# Altium schematic sheet Processor.SchDoc
size A2; Organization: Altium Limited; Address1: L3, 12a Rodborough Rd; Address2: Frenchs Forest; Address3: NSW; Address4: Australia 2086
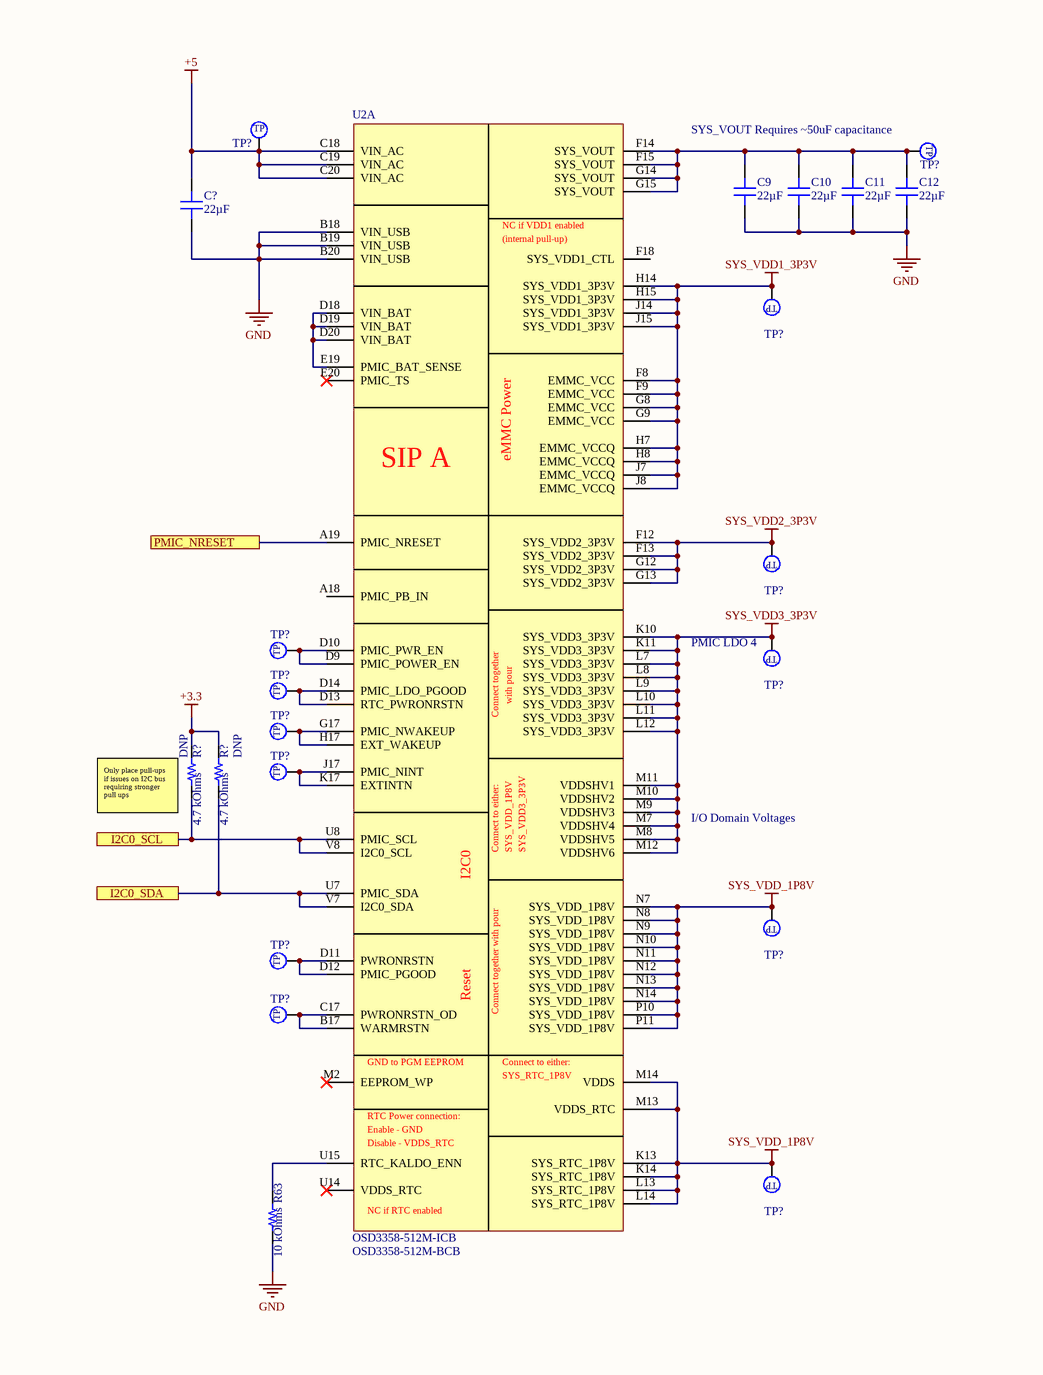
[diagram p0: Processor.SchDoc, left]
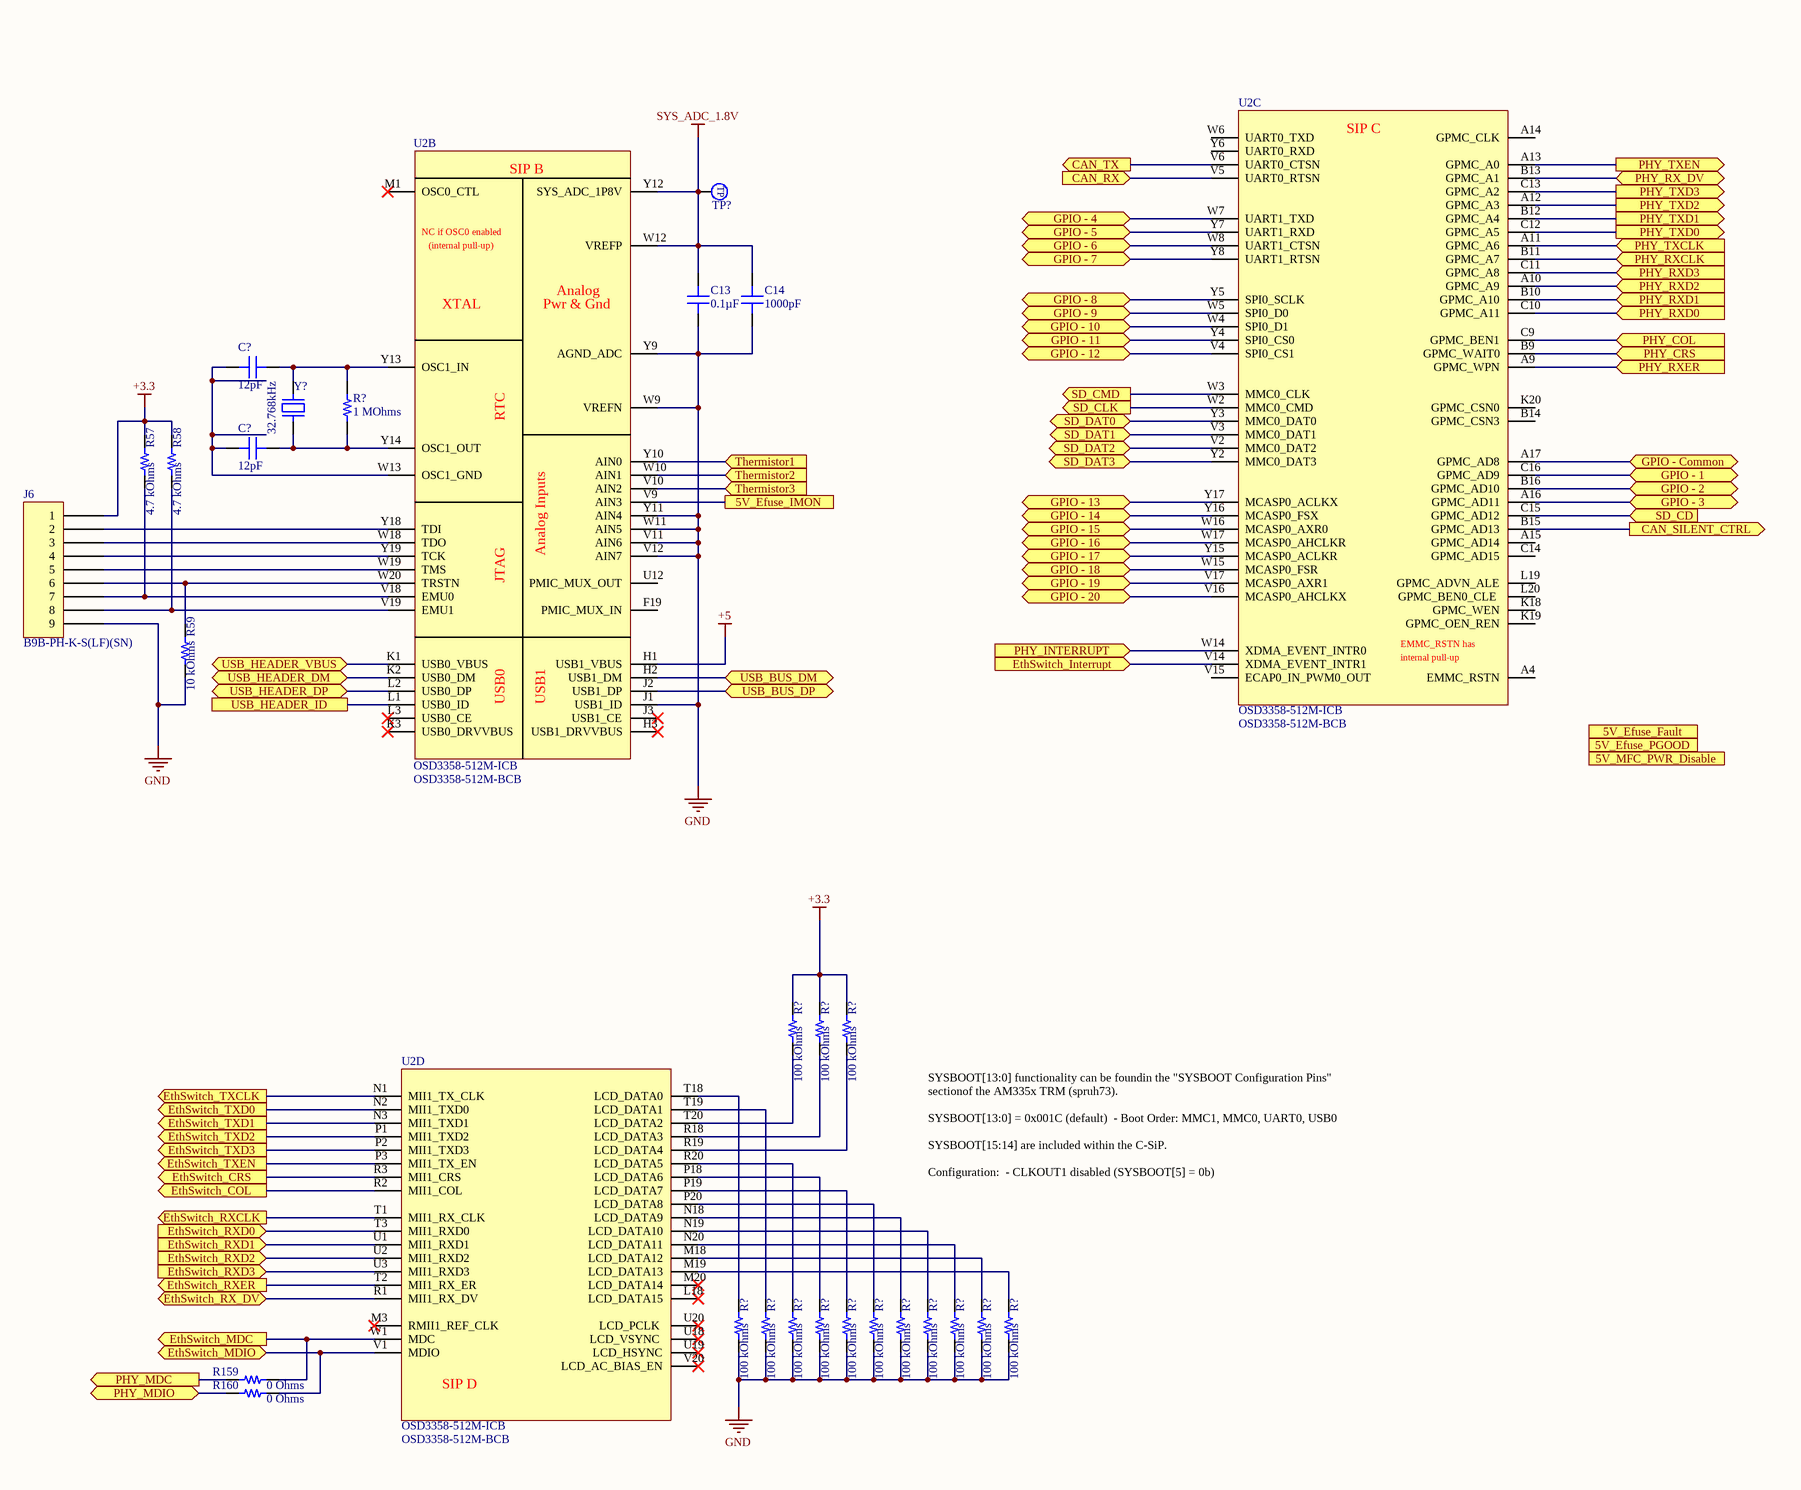
[diagram p1: Processor.SchDoc, right]

## Parts
(Parts that share a designator on the sheet are numbered #1, #2 ... from top to bottom, then left to right.)
C9  22µF  [CAP 0805_2012]
C10  22µF  [CAP 0805_2012]
C11  22µF  [CAP 0805_2012]
C12  22µF  [CAP 0805_2012]
C13  0.1µF  [CAP 0603_1608]
C14  1000pF  [CAP 0603_1608]
C?#1  22µF  [CAP 0805_2012]
C?#2  12pF  [CAP 0603_1608]
C?#3  12pF  [CAP 0603_1608]
J6  B9B-PH-K-S(LF)(SN)  [JST B9B-PH-K]
R57  4.7 kOhms  [RES 0603_1608]
R58  4.7 kOhms  [RES 0603_1608]
R59  10 kOhms  [RES 0603_1608]
R63  10 kOhms  [RES 0603_1608]
R159  0 Ohms  [RES 0603_1608]
R160  0 Ohms  [RES 0603_1608]
R?#1  1 MOhms  [RES 0603_1608]
R?#2  4.7 kOhms  [RES 0603_1608]
R?#3  4.7 kOhms  [RES 0603_1608]
R?#4  100 kOhms  [RES 0603_1608]
R?#5  100 kOhms  [RES 0603_1608]
R?#6  100 kOhms  [RES 0603_1608]
R?#7  100 kOhms  [RES 0603_1608]
R?#8  100 kOhms  [RES 0603_1608]
R?#9  100 kOhms  [RES 0603_1608]
R?#10  100 kOhms  [RES 0603_1608]
R?#11  100 kOhms  [RES 0603_1608]
R?#12  100 kOhms  [RES 0603_1608]
R?#13  100 kOhms  [RES 0603_1608]
R?#14  100 kOhms  [RES 0603_1608]
R?#15  100 kOhms  [RES 0603_1608]
R?#16  100 kOhms  [RES 0603_1608]
R?#17  100 kOhms  [RES 0603_1608]
TP?#1  2.5mm_SMD_TestPoint  [2.5mm TestPoint]  (value not drawn)
TP?#2  2.5mm_SMD_TestPoint  [2.5mm TestPoint]  (value not drawn)
TP?#3  2.5mm_SMD_TestPoint  [2.5mm TestPoint]  (value not drawn)
TP?#4  2.5mm_SMD_TestPoint  [2.5mm TestPoint]  (value not drawn)
TP?#5  2.5mm_SMD_TestPoint  [2.5mm TestPoint]  (value not drawn)
TP?#6  2.5mm_SMD_TestPoint  [2.5mm TestPoint]  (value not drawn)
TP?#7  2.5mm_SMD_TestPoint  [2.5mm TestPoint]  (value not drawn)
TP?#8  2.5mm_SMD_TestPoint  [2.5mm TestPoint]  (value not drawn)
TP?#9  2.5mm_SMD_TestPoint  [2.5mm TestPoint]  (value not drawn)
TP?#10  2.5mm_SMD_TestPoint  [2.5mm TestPoint]  (value not drawn)
TP?#11  2.5mm_SMD_TestPoint  [2.5mm TestPoint]  (value not drawn)
TP?#12  2.5mm_SMD_TestPoint  [2.5mm TestPoint]  (value not drawn)
TP?#13  2.5mm_SMD_TestPoint  [2.5mm TestPoint]  (value not drawn)
TP?#14  2.5mm_SMD_TestPoint  [2.5mm TestPoint]  (value not drawn)
U2  OSD3358-512M-ICB  PartNumber: OSD3358-512M-BCB  [BGA_20x20_400_1p27mm]  (parts A,B,C,D of 7)
Y?  32.768kHz  [ABRACON ABS07]

## Ports
5V_Efuse_Fault, 5V_Efuse_IMON, 5V_Efuse_PGOOD, 5V_MFC_PWR_Disable, CAN_RX (in), CAN_SILENT_CTRL (out), CAN_TX (out), EthSwitch_COL (out), EthSwitch_CRS (out), EthSwitch_Interrupt (in), EthSwitch_MDC (out), EthSwitch_MDIO (bidir), EthSwitch_RX_DV (bidir), EthSwitch_RXCLK (out), EthSwitch_RXD0 (in), EthSwitch_RXD1 (in), EthSwitch_RXD2 (in), EthSwitch_RXD3 (in), EthSwitch_RXER (out), EthSwitch_TXCLK (out), EthSwitch_TXD0 (out), EthSwitch_TXD1 (out), EthSwitch_TXD2 (out), EthSwitch_TXD3 (out), EthSwitch_TXEN (out), GPIO - 1 (bidir), GPIO - 2 (bidir), GPIO - 3 (bidir), GPIO - 4 (bidir), GPIO - 5 (bidir), GPIO - 6 (bidir), GPIO - 7 (bidir), GPIO - 8 (bidir), GPIO - 9 (bidir), GPIO - 10 (bidir), GPIO - 11 (bidir), GPIO - 12 (bidir), GPIO - 13 (bidir), GPIO - 14 (bidir), GPIO - 15 (bidir), GPIO - 16 (bidir), GPIO - 17 (bidir), GPIO - 18 (bidir), GPIO - 19 (bidir), GPIO - 20 (bidir), GPIO - Common (bidir), I2C0_SCL, I2C0_SDA, PHY_COL (in), PHY_CRS (in), PHY_INTERRUPT (in), PHY_MDC (out), PHY_MDIO (bidir), PHY_RX_DV (bidir), PHY_RXCLK (in), PHY_RXD0 (in), PHY_RXD1 (in), PHY_RXD2 (in), PHY_RXD3 (in), PHY_RXER (in), PHY_TXCLK (in), PHY_TXD0 (out), PHY_TXD1 (out), PHY_TXD2 (out), PHY_TXD3 (out), PHY_TXEN (out), PMIC_NRESET, SD_CD (in), SD_CLK (out), SD_CMD (out), SD_DAT0 (bidir), SD_DAT1 (bidir), SD_DAT2 (bidir), SD_DAT3 (bidir), Thermistor1 (in), Thermistor2 (in), Thermistor3 (in), USB_BUS_DM (bidir), USB_BUS_DP (bidir), USB_HEADER_DM (bidir), USB_HEADER_DP (bidir), USB_HEADER_ID, USB_HEADER_VBUS (bidir)

## Nets
+3.3: J6.1 R57.2 R58.2 R?#2.2 R?#3.2 R?#4.2 R?#5.2 R?#6.2
+5: C?#1.2 TP?#1.1 U2.C18(VIN_AC) U2.C19(VIN_AC) U2.C20(VIN_AC) U2.H1(USB1_VBUS)
GND: C9.1 C10.1 C11.1 C12.1 C13.1 C14.1 C?#1.1 J6.9 R59.1 R63.1 R?#7.1 R?#8.1 R?#9.1 R?#10.1 R?#11.1 R?#12.1 R?#13.1 R?#14.1 R?#15.1 R?#16.1 R?#17.1 U2.B18(VIN_USB) U2.B19(VIN_USB) U2.B20(VIN_USB) U2.J1(USB1_ID) U2.V11(AIN6) U2.V12(AIN7) U2.W9(VREFN) U2.W11(AIN5) U2.Y9(AGND_ADC) U2.Y11(AIN4)
SYS_ADC_1.8V: C13.2 C14.2 TP?#3.1 U2.W12(VREFP) U2.Y12(SYS_ADC_1P8V)
SYS_VDD1_3P3V: TP?#4.1 U2.F8(EMMC_VCC) U2.F9(EMMC_VCC) U2.G8(EMMC_VCC) U2.G9(EMMC_VCC) U2.H7(EMMC_VCCQ) U2.H8(EMMC_VCCQ) U2.H14(SYS_VDD1_3P3V) U2.H15(SYS_VDD1_3P3V) U2.J7(EMMC_VCCQ) U2.J8(EMMC_VCCQ) U2.J14(SYS_VDD1_3P3V) U2.J15(SYS_VDD1_3P3V)
SYS_VDD2_3P3V: TP?#5.1 U2.F12(SYS_VDD2_3P3V) U2.F13(SYS_VDD2_3P3V) U2.G12(SYS_VDD2_3P3V) U2.G13(SYS_VDD2_3P3V)
SYS_VDD3_3P3V: TP?#6.1 U2.K10(SYS_VDD3_3P3V) U2.K11(SYS_VDD3_3P3V) U2.L7(SYS_VDD3_3P3V) U2.L8(SYS_VDD3_3P3V) U2.L9(SYS_VDD3_3P3V) U2.L10(SYS_VDD3_3P3V) U2.L11(SYS_VDD3_3P3V) U2.L12(SYS_VDD3_3P3V) U2.M7(VDDSHV4) U2.M8(VDDSHV5) U2.M9(VDDSHV3) U2.M10(VDDSHV2) U2.M11(VDDSHV1) U2.M12(VDDSHV6)
SYS_VDD_1P8V: TP?#11.1 TP?#14.1 U2.K13(SYS_RTC_1P8V) U2.K14(SYS_RTC_1P8V) U2.L13(SYS_RTC_1P8V) U2.L14(SYS_RTC_1P8V) U2.M13(VDDS_RTC) U2.M14(VDDS) U2.N7(SYS_VDD_1P8V) U2.N8(SYS_VDD_1P8V) U2.N9(SYS_VDD_1P8V) U2.N10(SYS_VDD_1P8V) U2.N11(SYS_VDD_1P8V) U2.N12(SYS_VDD_1P8V) U2.N13(SYS_VDD_1P8V) U2.N14(SYS_VDD_1P8V) U2.P10(SYS_VDD_1P8V) U2.P11(SYS_VDD_1P8V)
5V_Efuse_IMON: U2.V9(AIN3) ; port 5V_Efuse_IMON
CAN_RX: U2.V5(UART0_RTSN) ; port CAN_RX
CAN_SILENT_CTRL: U2.B15(GPMC_AD13) ; port CAN_SILENT_CTRL
CAN_TX: U2.V6(UART0_CTSN) ; port CAN_TX
EthSwitch_COL: U2.R2(MII1_COL) ; port EthSwitch_COL
EthSwitch_CRS: U2.R3(MII1_CRS) ; port EthSwitch_CRS
EthSwitch_Interrupt: U2.V14(XDMA_EVENT_INTR1) ; port EthSwitch_Interrupt
EthSwitch_MDC: R159.2 U2.W1(MDC) ; port EthSwitch_MDC
EthSwitch_MDIO: R160.2 U2.V1(MDIO) ; port EthSwitch_MDIO
EthSwitch_RX_DV: U2.R1(MII1_RX_DV) ; port EthSwitch_RX_DV
EthSwitch_RXCLK: U2.T1(MII1_RX_CLK) ; port EthSwitch_RXCLK
EthSwitch_RXD0: U2.T3(MII1_RXD0) ; port EthSwitch_RXD0
EthSwitch_RXD1: U2.U1(MII1_RXD1) ; port EthSwitch_RXD1
EthSwitch_RXD2: U2.U2(MII1_RXD2) ; port EthSwitch_RXD2
EthSwitch_RXD3: U2.U3(MII1_RXD3) ; port EthSwitch_RXD3
EthSwitch_RXER: U2.T2(MII1_RX_ER) ; port EthSwitch_RXER
EthSwitch_TXCLK: U2.N1(MII1_TX_CLK) ; port EthSwitch_TXCLK
EthSwitch_TXD0: U2.N2(MII1_TXD0) ; port EthSwitch_TXD0
EthSwitch_TXD1: U2.N3(MII1_TXD1) ; port EthSwitch_TXD1
EthSwitch_TXD2: U2.P1(MII1_TXD2) ; port EthSwitch_TXD2
EthSwitch_TXD3: U2.P2(MII1_TXD3) ; port EthSwitch_TXD3
EthSwitch_TXEN: U2.P3(MII1_TX_EN) ; port EthSwitch_TXEN
GPIO - 1: U2.C16(GPMC_AD9) ; port GPIO - 1
GPIO - 2: U2.B16(GPMC_AD10) ; port GPIO - 2
GPIO - 3: U2.A16(GPMC_AD11) ; port GPIO - 3
GPIO - 4: U2.W7(UART1_TXD) ; port GPIO - 4
GPIO - 5: U2.Y7(UART1_RXD) ; port GPIO - 5
GPIO - 6: U2.W8(UART1_CTSN) ; port GPIO - 6
GPIO - 7: U2.Y8(UART1_RTSN) ; port GPIO - 7
GPIO - 8: U2.Y5(SPI0_SCLK) ; port GPIO - 8
GPIO - 9: U2.W5(SPI0_D0) ; port GPIO - 9
GPIO - 10: U2.W4(SPI0_D1) ; port GPIO - 10
GPIO - 11: U2.Y4(SPI0_CS0) ; port GPIO - 11
GPIO - 12: U2.V4(SPI0_CS1) ; port GPIO - 12
GPIO - 13: U2.Y17(MCASP0_ACLKX) ; port GPIO - 13
GPIO - 14: U2.Y16(MCASP0_FSX) ; port GPIO - 14
GPIO - 15: U2.W16(MCASP0_AXR0) ; port GPIO - 15
GPIO - 16: U2.W17(MCASP0_AHCLKR) ; port GPIO - 16
GPIO - 17: U2.Y15(MCASP0_ACLKR) ; port GPIO - 17
GPIO - 18: U2.W15(MCASP0_FSR) ; port GPIO - 18
GPIO - 19: U2.V17(MCASP0_AXR1) ; port GPIO - 19
GPIO - 20: U2.V16(MCASP0_AHCLKX) ; port GPIO - 20
GPIO - Common: U2.A17(GPMC_AD8) ; port GPIO - Common
I2C0_SCL: R?#2.1 U2.U8(PMIC_SCL) U2.V8(I2C0_SCL) ; port I2C0_SCL
I2C0_SDA: R?#3.1 U2.U7(PMIC_SDA) U2.V7(I2C0_SDA) ; port I2C0_SDA
PHY_COL: U2.C9(GPMC_BEN1) ; port PHY_COL
PHY_CRS: U2.B9(GPMC_WAIT0) ; port PHY_CRS
PHY_INTERRUPT: U2.W14(XDMA_EVENT_INTR0) ; port PHY_INTERRUPT
PHY_MDC: R159.1 ; port PHY_MDC
PHY_MDIO: R160.1 ; port PHY_MDIO
PHY_RX_DV: U2.B13(GPMC_A1) ; port PHY_RX_DV
PHY_RXCLK: U2.B11(GPMC_A7) ; port PHY_RXCLK
PHY_RXD0: U2.C10(GPMC_A11) ; port PHY_RXD0
PHY_RXD1: U2.B10(GPMC_A10) ; port PHY_RXD1
PHY_RXD2: U2.A10(GPMC_A9) ; port PHY_RXD2
PHY_RXD3: U2.C11(GPMC_A8) ; port PHY_RXD3
PHY_RXER: U2.A9(GPMC_WPN) ; port PHY_RXER
PHY_TXCLK: U2.A11(GPMC_A6) ; port PHY_TXCLK
PHY_TXD0: U2.C12(GPMC_A5) ; port PHY_TXD0
PHY_TXD1: U2.B12(GPMC_A4) ; port PHY_TXD1
PHY_TXD2: U2.A12(GPMC_A3) ; port PHY_TXD2
PHY_TXD3: U2.C13(GPMC_A2) ; port PHY_TXD3
PHY_TXEN: U2.A13(GPMC_A0) ; port PHY_TXEN
PMIC_NRESET: U2.A19(PMIC_NRESET) ; port PMIC_NRESET
SD_CD: U2.C15(GPMC_AD12) ; port SD_CD
SD_CLK: U2.W2(MMC0_CMD) ; port SD_CLK
SD_CMD: U2.W3(MMC0_CLK) ; port SD_CMD
SD_DAT0: U2.Y3(MMC0_DAT0) ; port SD_DAT0
SD_DAT1: U2.V3(MMC0_DAT1) ; port SD_DAT1
SD_DAT2: U2.V2(MMC0_DAT2) ; port SD_DAT2
SD_DAT3: U2.Y2(MMC0_DAT3) ; port SD_DAT3
Thermistor1: U2.Y10(AIN0) ; port Thermistor1
Thermistor2: U2.W10(AIN1) ; port Thermistor2
Thermistor3: U2.V10(AIN2) ; port Thermistor3
USB_BUS_DM: U2.H2(USB1_DM) ; port USB_BUS_DM
USB_BUS_DP: U2.J2(USB1_DP) ; port USB_BUS_DP
USB_HEADER_DM: U2.K2(USB0_DM) ; port USB_HEADER_DM
USB_HEADER_DP: U2.L2(USB0_DP) ; port USB_HEADER_DP
USB_HEADER_ID: U2.L1(USB0_ID) ; port USB_HEADER_ID
USB_HEADER_VBUS: U2.K1(USB0_VBUS) ; port USB_HEADER_VBUS
NetC9_2: C9.2 C10.2 C11.2 C12.2 TP?#2.1 U2.F14(SYS_VOUT) U2.F15(SYS_VOUT) U2.G14(SYS_VOUT) U2.G15(SYS_VOUT)
NetC?#2_1: C?#2.1 C?#3.1 U2.W13(OSC1_GND)
NetC?#2_2: C?#2.2 R?#1.2 U2.Y13(OSC1_IN) Y?.2
NetC?#3_2: C?#3.2 R?#1.1 U2.Y14(OSC1_OUT) Y?.1
NetJ6_2: J6.2 U2.Y18(TDI)
NetJ6_3: J6.3 U2.W18(TDO)
NetJ6_4: J6.4 U2.Y19(TCK)
NetJ6_5: J6.5 U2.W19(TMS)
NetJ6_6: J6.6 R59.2 U2.W20(TRSTN)
NetJ6_7: J6.7 R57.1 U2.V18(EMU0)
NetJ6_8: J6.8 R58.1 U2.V19(EMU1)
NetR63_2: R63.2 U2.U15(RTC_KALDO_ENN)
NetR?#4_1: R?#4.1 U2.T20(LCD_DATA2)
NetR?#5_1: R?#5.1 U2.R18(LCD_DATA3)
NetR?#6_1: R?#6.1 U2.R19(LCD_DATA4)
NetR?#7_2: R?#7.2 U2.T18(LCD_DATA0)
NetR?#8_2: R?#8.2 U2.T19(LCD_DATA1)
NetR?#9_2: R?#9.2 U2.R20(LCD_DATA5)
NetR?#10_2: R?#10.2 U2.P18(LCD_DATA6)
NetR?#11_2: R?#11.2 U2.P19(LCD_DATA7)
NetR?#12_2: R?#12.2 U2.P20(LCD_DATA8)
NetR?#13_2: R?#13.2 U2.N18(LCD_DATA9)
NetR?#14_2: R?#14.2 U2.N19(LCD_DATA10)
NetR?#15_2: R?#15.2 U2.N20(LCD_DATA11)
NetR?#16_2: R?#16.2 U2.M18(LCD_DATA12)
NetR?#17_2: R?#17.2 U2.M19(LCD_DATA13)
NetTP?#7_1: TP?#7.1 U2.D9(PMIC_POWER_EN) U2.D10(PMIC_PWR_EN)
NetTP?#8_1: TP?#8.1 U2.D13(RTC_PWRONRSTN) U2.D14(PMIC_LDO_PGOOD)
NetTP?#9_1: TP?#9.1 U2.G17(PMIC_NWAKEUP) U2.H17(EXT_WAKEUP)
NetTP?#10_1: TP?#10.1 U2.J17(PMIC_NINT) U2.K17(EXTINTN)
NetTP?#12_1: TP?#12.1 U2.D11(PWRONRSTN) U2.D12(PMIC_PGOOD)
NetTP?#13_1: TP?#13.1 U2.B17(WARMRSTN) U2.C17(PWRONRSTN_OD)
NetU2_D18: U2.D18(VIN_BAT) U2.D19(VIN_BAT) U2.D20(VIN_BAT) U2.E19(PMIC_BAT_SENSE)

Not connected (* = marked no-connect by the designer): U2 A4(EMMC_RSTN) A14(GPMC_CLK) A15(GPMC_AD14) A18(PMIC_PB_IN) B14(GPMC_CSN3) C14(GPMC_AD15) E20(PMIC_TS)* F18(SYS_VDD1_CTL) F19(PMIC_MUX_IN) H3(USB1_DRVVBUS)* J3(USB1_CE)* K3(USB0_DRVVBUS)* K18(GPMC_WEN) K19(GPMC_OEN_REN) K20(GPMC_CSN0) L3(USB0_CE)* L18(LCD_DATA15)* L19(GPMC_ADVN_ALE) L20(GPMC_BEN0_CLE_) M1(OSC0_CTL)* M2(EEPROM_WP)* M3(RMII1_REF_CLK)* M20(LCD_DATA14)* U12(PMIC_MUX_OUT) U14(VDDS_RTC)* U18(LCD_VSYNC_)* U19(LCD_HSYNC)* U20(LCD_PCLK_)* V15(ECAP0_IN_PWM0_OUT) V20(LCD_AC_BIAS_EN)* W6(UART0_TXD) Y6(UART0_RXD)

## Notes on the sheet
- (near TP?#2) SYS_VOUT Requires ~50uF capacitance
- (near TP?#6) PMIC LDO 4
- (near R?#2) DNP
- (near R?#3) DNP
- (near R?#2) Only place pull-ups if issues on I2C bus requiring stronger pull ups
- I/O Domain Voltages
- SYSBOOT[13:0] functionality can be foundin the "SYSBOOT Configuration Pins" sectionof the AM335x TRM (spruh73).
  SYSBOOT[13:0] = 0x001C (default)  - Boot Order: MMC1, MMC0, UART0, USB0
  SYSBOOT[15:14] are included within the C-SiP.
  Configuration:  - CLKOUT1 disabled (SYSBOOT[5] = 0b)
- Title
- Size:
- Date:
- File:
- A2
- Number:
- Time:
- Revision:
- Sheet
- of
- (in symbol 2.5mm_SMD_TestPoint) TP
- (in symbol OSD3358-512M-ICB, part A) NC if VDD1 enabled; (internal pull-up); eMMC Power; SIP A; with pour; Connect together; Connect to either:; I2C0; Reset; Connect together with pour; GND to PGM EEPROM; RTC Power connection:; Enable - GND; Disable - VDDS_RTC; NC if RTC enabled
- (in symbol OSD3358-512M-ICB, part B) SIP B; NC if OSC0 enabled; (internal pull-up); Analog; XTAL; Pwr & Gnd; RTC; Analog Inputs; JTAG; USB0; USB1
- (in symbol OSD3358-512M-ICB, part C) SIP C; EMMC_RSTN has; internal pull-up
- (in symbol OSD3358-512M-ICB, part D) SIP D

## Library data of the parts
C9-C12 C?#1 = CL21A226KPCLRNC: CAP CER 22UF 10V X5R 0805; Manufacturer: Samsung Electro-Mechanics; Tolerance: ±10%; Part Number: CL21A226KPCLRNC; Value: 22µF; Applications: General Purpose; Capacitance: 22µF; ComponentLink1Description: Datasheet; ComponentLink1URL: http://www.samsungsem.com/kr/support/product-search/mlcc/CL21A226KPCLRNC.jsp; ComponentLink2Description: DigiKey Link; ComponentLink2URL: http://digikey.com/product-detail/en/samsung-electro-mechanics/CL21A226KPCLRNC/1276-6786-1-ND/5961645; Device Package: 0805 (2012 Metric); Features: Low Profile; LastUpdated: 9/2/2020 1:04:38 AM; Lifecycle Status: Active; Minimum Order: 1; Mounting Type: Surface Mount, MLCC; Operating Temperature: -55°C ~ 85°C; Package / Case: 0805 (2012 Metric); Packaging: TapeAndReel; PartId: 4833; Part Status: Active; Price: 0.08; Series: CL; Size / Dimension: 0.079" L x 0.049" W (2.00mm x 1.25mm); Supplier 1: DigiKey; Supplier Part Number 1: 1276-6786-1-ND; Temperature Coefficient: X5R; Thickness (Max): 0.037" (0.95mm); Voltage - Rated: 10V
C13 = CL10B104KA8WPNC: CAP CER 0.1UF 25V X7R 0603; Manufacturer: Samsung Electro-Mechanics; Tolerance: ±10%; Part Number: CL10B104KA8WPNC; Value: 0.1µF; Applications: Automotive; Capacitance: 0.1µF; ComponentLink1Description: Datasheet; ComponentLink1URL: http://www.samsungsem.com/kr/support/product-search/mlcc/CL10B104KA8WPNC.jsp; ComponentLink2Description: DigiKey Link; ComponentLink2URL: http://digikey.com/product-detail/en/samsung-electro-mechanics/CL10B104KA8WPNC/1276-6717-1-ND/5961576; Device Package: 0603 (1608 Metric); Features: Open Mode; LastUpdated: 9/2/2020 1:03:30 AM; Lifecycle Status: Active; Minimum Order: 1; Mounting Type: Surface Mount, MLCC; Operating Temperature: -55°C ~ 125°C; Package / Case: 0603 (1608 Metric); Packaging: TapeAndReel; PartId: 5631; Part Status: Active; Price: 0.02; Ratings: AEC-Q200; Series: CL; Size / Dimension: 0.063" L x 0.031" W (1.60mm x 0.80mm); Supplier 1: DigiKey; Supplier Part Number 1: 1276-6717-1-ND; Temperature Coefficient: X7R; Thickness (Max): 0.035" (0.90mm); Voltage - Rated: 25V
C14 = CC0603KRX7R7BB102: CAP CER 1000PF 16V X7R 0603; Manufacturer: Yageo; Tolerance: ±10%; Part Number: CC0603KRX7R7BB102; Value: 1000pF; Applications: General Purpose; Capacitance: 1000pF; ComponentLink1Description: Datasheet; ComponentLink1URL: https://www.yageo.com/upload/media/product/productsearch/datasheet/mlcc/UPY-GPHC_X7R_6.3V-to-50V_18.pdf; ComponentLink2Description: DigiKey Link; ComponentLink2URL: http://digikey.com/product-detail/en/yageo/CC0603KRX7R7BB102/311-4063-1-ND/8025152; Device Package: 0603 (1608 Metric); LastUpdated: 9/2/2020 1:03:23 AM; Lifecycle Status: Active; Minimum Order: 1; Mounting Type: Surface Mount, MLCC; Operating Temperature: -55°C ~ 125°C; Package / Case: 0603 (1608 Metric); Packaging: TapeAndReel; PartId: 9301; Part Status: Active; Price: 0.01; Series: CC; Size / Dimension: 0.063" L x 0.031" W (1.60mm x 0.80mm); Supplier 1: DigiKey; Supplier Part Number 1: 311-4063-1-ND; Temperature Coefficient: X7R; Thickness (Max): 0.035" (0.90mm); Voltage - Rated: 16V
C?#2 C?#3 = CL10C120JB8NNNC: CAP CER 12PF 50V C0G/NP0 0603; Manufacturer: Samsung Electro-Mechanics; Temperature Coefficient: C0G, NP0; Tolerance: ±5%; Part Number: CL10C120JB8NNNC; Value: 12pF; Applications: General Purpose; Capacitance: 12pF; ComponentLink1Description: Datasheet; ComponentLink1URL: http://www.samsungsem.com/kr/support/product-search/mlcc/CL10C120JB8NNNC.jsp; ComponentLink2Description: DigiKey Link; ComponentLink2URL: http://digikey.com/product-detail/en/samsung-electro-mechanics/CL10C120JB8NNNC/1276-1254-1-ND/3889340; Device Package: 0603 (1608 Metric); LastUpdated: 9/2/2020 1:03:30 AM; Lifecycle Status: Active; Minimum Order: 1; Mounting Type: Surface Mount, MLCC; Operating Temperature: -55°C ~ 125°C; Package / Case: 0603 (1608 Metric); Packaging: TapeAndReel; PartId: 5734; Part Status: Active; Price: 0.01; Series: CL; Size / Dimension: 0.063" L x 0.031" W (1.60mm x 0.80mm); Supplier 1: DigiKey; Supplier Part Number 1: 1276-1254-1-ND; Thickness (Max): 0.035" (0.90mm); Voltage - Rated: 50V
J6 = B9B-PH-K-S(LF)(SN): CONN HEADER VERT 9POS 2MM; Manufacturer: JST Sales America Inc.; Contact Length - Mating: 0.130" (3.30mm); Contact Length - Post: 0.134" (3.40mm); Current Rating (Amps): 2A; Material Flammability Rating: UL94 V-0; Number of Positions: 9; Number of Positions Loaded: All; Overall Contact Length: 0.333" (8.45mm); Pitch - Mating: 0.079" (2.00mm); Shrouding: Shrouded - 4 Wall; Style: Board to Cable/Wire; Voltage Rating: 100V; Part Number: B9B-PH-K-S(LF)(SN); ComponentLink1Description: Datasheet; ComponentLink1URL: http://www.jst-mfg.com/product/pdf/eng/ePH.pdf; ComponentLink2Description: DigiKey Link; ComponentLink2URL: http://digikey.com/product-detail/en/jst-sales-america-inc/B9B-PH-K-S-LF-SN/455-1711-ND/926618; Connector Type: Header; Contact Finish - Mating: Tin; Contact Finish - Post: Tin; Contact Material: Brass; Contact Shape: Square; Contact Type: Male Pin; Fastening Type: Detent Lock; Insulation Color: Natural; Insulation Height: 0.236" (6.00mm); Insulation Material: Polyamide (PA66), Nylon 6/6; LastUpdated: 1/12/2020 10:30:56 PM; Lifecycle Status: Active; Minimum Order: 1; Mounting Type: Through Hole; Number of Rows: 1; Operating Temperature: -25°C ~ 85°C; Packaging: Bulk; PartId: 32; Part Status: Active; Price: 0.48; Series: PH; Supplier 1: DigiKey; Supplier Part Number 1: 455-1711-ND; Termination: Press-Fit, Solder
R57 R58 R?#2 R?#3 = RMCF0603FT4K70: RES 4.7K OHM 1% 1/10W 0603; Manufacturer: Stackpole Electronics Inc; Power (Watts): 0.1W, 1/10W; Temperature Coefficient: ±100ppm/°C; Part Number: RMCF0603FT4K70; Value: 4.7 kOhms; ComponentLink1Description: Datasheet; ComponentLink1URL: https://www.seielect.com/catalog/sei-rmcf_rmcp.pdf; ComponentLink2Description: DigiKey Link; ComponentLink2URL: http://digikey.com/product-detail/en/stackpole-electronics-inc/RMCF0603FT4K70/RMCF0603FT4K70CT-ND/1943033; Composition: Thick Film; Device Package: 0603 (1608 Metric); Features: Automotive AEC-Q200; Height - Seated (Max): 0.022" (0.55mm); LastUpdated: 9/2/2020 1:10:22 AM; Lifecycle Status: Active; Minimum Order: 1; Number of Terminations: 2; Operating Temperature: -55°C ~ 155°C; Package / Case: 0603 (1608 Metric); Packaging: CutTape; PartId: 6078; Part Status: Active; Price: 0.10; Ratings: AEC-Q200; Resistance: 4.7 kOhms; Series: RMCF; Size / Dimension: 0.061" L x 0.031" W (1.55mm x 0.80mm); Supplier 1: DigiKey; Supplier Part Number 1: RMCF0603FT4K70CT-ND; Supplier Device Package: 0603; Tolerance: ±1%
R59 R63 = RMCF0603JT10K0: RES 10K OHM 5% 1/10W 0603; Manufacturer: Stackpole Electronics Inc; Power (Watts): 0.1W, 1/10W; Temperature Coefficient: ±200ppm/°C; Part Number: RMCF0603JT10K0; Value: 10 kOhms; ComponentLink1Description: Datasheet; ComponentLink1URL: https://www.seielect.com/catalog/sei-packaging.pdf; ComponentLink2Description: DigiKey Link; ComponentLink2URL: http://digikey.com/product-detail/en/stackpole-electronics-inc/RMCF0603JT10K0/RMCF0603JT10K0CT-ND/1943191; Composition: Thick Film; Device Package: 0603 (1608 Metric); Features: Automotive AEC-Q200; Height - Seated (Max): 0.022" (0.55mm); LastUpdated: 8/30/2020 8:48:45 PM; Lifecycle Status: Active; Minimum Order: 1; Number of Terminations: 2; Operating Temperature: -55°C ~ 155°C; Package / Case: 0603 (1608 Metric); Packaging: CutTape; PartId: 25659; Part Status: Active; Price: 0.10; Ratings: AEC-Q200; Resistance: 10 kOhms; Series: RMCF; Size / Dimension: 0.061" L x 0.031" W (1.55mm x 0.80mm); Supplier 1: DigiKey; Supplier Part Number 1: RMCF0603JT10K0CT-ND; Supplier Device Package: 0603; Tolerance: ±5%
R159 R160 = RMCF0603ZT0R00: RES 0 OHM JUMPER 1/10W 0603; Manufacturer: Stackpole Electronics Inc; Power (Watts): 0.1W, 1/10W; Part Number: RMCF0603ZT0R00; Value: 0 Ohms; ComponentLink1Description: Datasheet; ComponentLink1URL: https://www.seielect.com/catalog/sei-rmcf_rmcp.pdf; ComponentLink2Description: DigiKey Link; ComponentLink2URL: http://digikey.com/product-detail/en/stackpole-electronics-inc/RMCF0603ZT0R00/RMCF0603ZT0R00CT-ND/1943218; Composition: Thick Film; Device Package: 0603 (1608 Metric); Features: Automotive AEC-Q200; Height - Seated (Max): 0.022" (0.55mm); LastUpdated: 9/2/2020 1:09:45 AM; Lifecycle Status: Active; Minimum Order: 1; Number of Terminations: 2; Operating Temperature: -55°C ~ 155°C; Package / Case: 0603 (1608 Metric); Packaging: CutTape; PartId: 22613; Part Status: Active; Price: 0.10; Ratings: AEC-Q200; Resistance: 0 Ohms; Series: RMCF; Size / Dimension: 0.061" L x 0.031" W (1.55mm x 0.80mm); Supplier 1: DigiKey; Supplier Part Number 1: RMCF0603ZT0R00CT-ND; Supplier Device Package: 0603; Tolerance: Jumper
R?#1 = RMCF0603FG1M00: RES 1M OHM 1% 1/10W 0603; Manufacturer: Stackpole Electronics Inc; Power (Watts): 0.1W, 1/10W; Temperature Coefficient: ±100ppm/°C; Part Number: RMCF0603FG1M00; Value: 1 MOhms; ComponentLink1Description: Datasheet; ComponentLink1URL: https://www.seielect.com/catalog/sei-packaging.pdf; ComponentLink2Description: DigiKey Link; ComponentLink2URL: http://digikey.com/product-detail/en/stackpole-electronics-inc/RMCF0603FG1M00/RMCF0603FG1M00CT-ND/4425038; Composition: Thick Film; Device Package: 0603 (1608 Metric); Features: Automotive AEC-Q200; Height - Seated (Max): 0.022" (0.55mm); LastUpdated: 9/2/2020 1:09:39 AM; Lifecycle Status: Active; Minimum Order: 1; Number of Terminations: 2; Operating Temperature: -55°C ~ 155°C; Package / Case: 0603 (1608 Metric); Packaging: CutTape; PartId: 24037; Part Status: Active; Price: 0.10; Ratings: AEC-Q200; Resistance: 1 MOhms; Series: RMCF; Size / Dimension: 0.061" L x 0.031" W (1.55mm x 0.80mm); Supplier 1: DigiKey; Supplier Part Number 1: RMCF0603FG1M00CT-ND; Supplier Device Package: 0603; Tolerance: ±1%
R?#4-R?#17 = RMCF0603FT100K: RES 100K OHM 1% 1/10W 0603; Manufacturer: Stackpole Electronics Inc; Power (Watts): 0.1W, 1/10W; Temperature Coefficient: ±100ppm/°C; Part Number: RMCF0603FT100K; Value: 100 kOhms; ComponentLink1Description: Datasheet; ComponentLink1URL: https://www.seielect.com/catalog/sei-packaging.pdf; ComponentLink2Description: DigiKey Link; ComponentLink2URL: http://digikey.com/product-detail/en/stackpole-electronics-inc/RMCF0603FT100K/RMCF0603FT100KCT-ND/1943118; Composition: Thick Film; Device Package: 0603 (1608 Metric); Features: Automotive AEC-Q200; Height - Seated (Max): 0.022" (0.55mm); LastUpdated: 9/2/2020 1:09:31 AM; Lifecycle Status: Active; Minimum Order: 1; Number of Terminations: 2; Operating Temperature: -55°C ~ 155°C; Package / Case: 0603 (1608 Metric); Packaging: CutTape; PartId: 25664; Part Status: Active; Price: 0.10; Ratings: AEC-Q200; Resistance: 100 kOhms; Series: RMCF; Size / Dimension: 0.061" L x 0.031" W (1.55mm x 0.80mm); Supplier 1: DigiKey; Supplier Part Number 1: RMCF0603FT100KCT-ND; Supplier Device Package: 0603; Tolerance: ±1%
U2 = OSD3358-512M-ICB: Octavo Systems OSD335x Family SiP:  27mm x 27mm, 1.27mm pitch 400 pin BGA contains AM3358, 512MB DDR3, TPS65217C, TL5209, 4KB EEPROM, 4GB eMMC, 24MHz oscillator, and passives.  Industrial Temperature (case):  -40C to 85C.; PackageDescription: 400-Ball Grid Array, 21x21x2.6 mm, Pitch 1.27 mm; Package: FBGA; Pin Count: 400-ball; Mounting Technology: Surface Mount; Manufacturer: Octavo Systems; ComponentLinkURL: www.octavosystems.com; PackageReference: FBGA-400
Y? = ABS07-32.768KHZ-T: CRYSTAL 32.7680KHZ 12.5PF SMD; Manufacturer: Abracon LLC; ESR (Equivalent Series Resistance): 70 kOhms; Frequency Tolerance: ±20ppm; Operating Mode: Fundamental; Part Number: ABS07-32.768KHZ-T; ComponentLink1Description: Datasheet; ComponentLink1URL: https://abracon.com/Resonators/ABS07.pdf; ComponentLink2Description: DigiKey Link; ComponentLink2URL: http://digikey.com/product-detail/en/abracon-llc/ABS07-32.768KHZ-T/535-9542-1-ND/1237009; Frequency: 32.768kHz; Height - Seated (Max): 0.035" (0.90mm); LastUpdated: 9/2/2020 1:21:47 AM; Lifecycle Status: Active; Load Capacitance: 12.5pF; Minimum Order: 1; Mounting Type: Surface Mount; Operating Temperature: -40°C ~ 85°C; Package / Case: 2-SMD, No Lead; Packaging: TapeAndReel; PartId: 382; Part Status: Active; Price: 0.32; Series: ABS07; Size / Dimension: 0.126" L x 0.059" W (3.20mm x 1.50mm); Supplier 1: DigiKey; Supplier Part Number 1: 535-9542-1-ND; Type: kHz Crystal (Tuning Fork); Value: 32.768kHz